# Altium project SPAM_LPF.PrjPcb
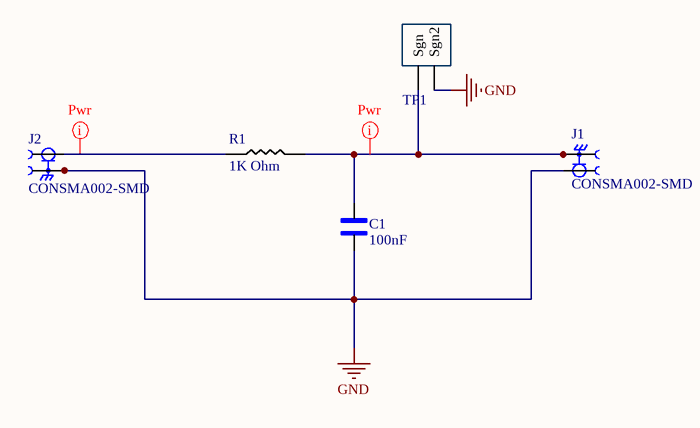
[diagram p0: SPAM_LPF_schematic.SchDoc]
1 sheet, 5 parts. Net scope: global (net labels, ports and power ports of the same name join across sheets).
Board file: PCB1.PcbDoc

## Sheet SPAM_LPF_schematic.SchDoc
size A3; SheetNumber: 1; SheetTotal: 1

### Parts
C1  100nF  [1206_Passive_Capacitor]
J1  CONSMA002-SMD  [TE_CONSMA002-SMD]
J2  CONSMA002-SMD  [TE_CONSMA002-SMD]
R1  value 1K Ohm  [1206_Passive_Resitor]  (hidden comment: 1k)
TP1  10x Probe TP  [TP_Diff_Probe]  (value not drawn)

### Nets
GND: C1.1 J1.1(SIG) J2.2(SH) J2.3(SH) TP1.2(Sgn2)
NetC1_2: C1.2 J1.2(SH) J1.3(SH) R1.2 TP1.1(Sgn)
NetJ2_1: J2.1(SIG) R1.1

### Layout directives
rule Width Constraint [Pref Width = 20mil    Min Width = 10mil    Max Width = 100mil]: NetC1_2, NetJ2_1

### Library data of the parts
C1 = C_100nF_1206: 100nF ±5% 50V C0G 1206 Multilayer Ceramic Capacitors MLCC - SMD/SMT RoHS; MFR Part #: GRM31M5C1H473JA01L; Type: Extended; LCSC Part#: C21812; Datasheet: https://datasheet.lcsc.com/lcsc/1810201313_Murata-Electronics-GRM31M5C1H473JA01L_C21812.pdf; Value: 100nF
R1 = R_1K_1206: CHIP RESISTOR - SURFACE MOUNT 1KOHMS ±1% 1/4W 1206 ROHS; MFR Part #: RNCP1206FTD1K00CT; Digikey Link: https://www.digikey.com/product-detail/en/RNCP1206FTD1K00/RNCP1206FTD1K00CT-ND/2240675/?itemSeq=304982373; LCSC Part#: C4410; Type: Basic
TP1 = TP_Diff_Probe: Test Point 300 mil centers
J1 J2 = CONSMA002-SMD: Package: None; Price: None; Value: *; MP: CONSMA002-SMD; Availability: Unavailable